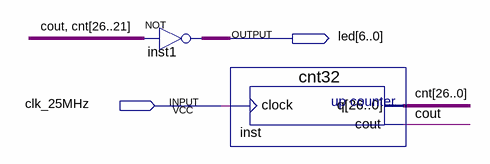
[diagram p0: schematic sheet]
// Quartus schematic lab_la.bdf as structural Verilog: 2 symbols, 2 pins
module lab_la (
  input  clk_25MHz,
  output [6:0] led
);

  wire cout;
  wire [26:0] cnt;

  assign led = ~{cout, cnt[26:21]};  // NOT inst1, 7 bits wide
  cnt32 inst (.clock(clk_25MHz), .cout(cout), .q(cnt));
endmodule
